# EAGLE design 220VAC power control (EAGLE 6.2)
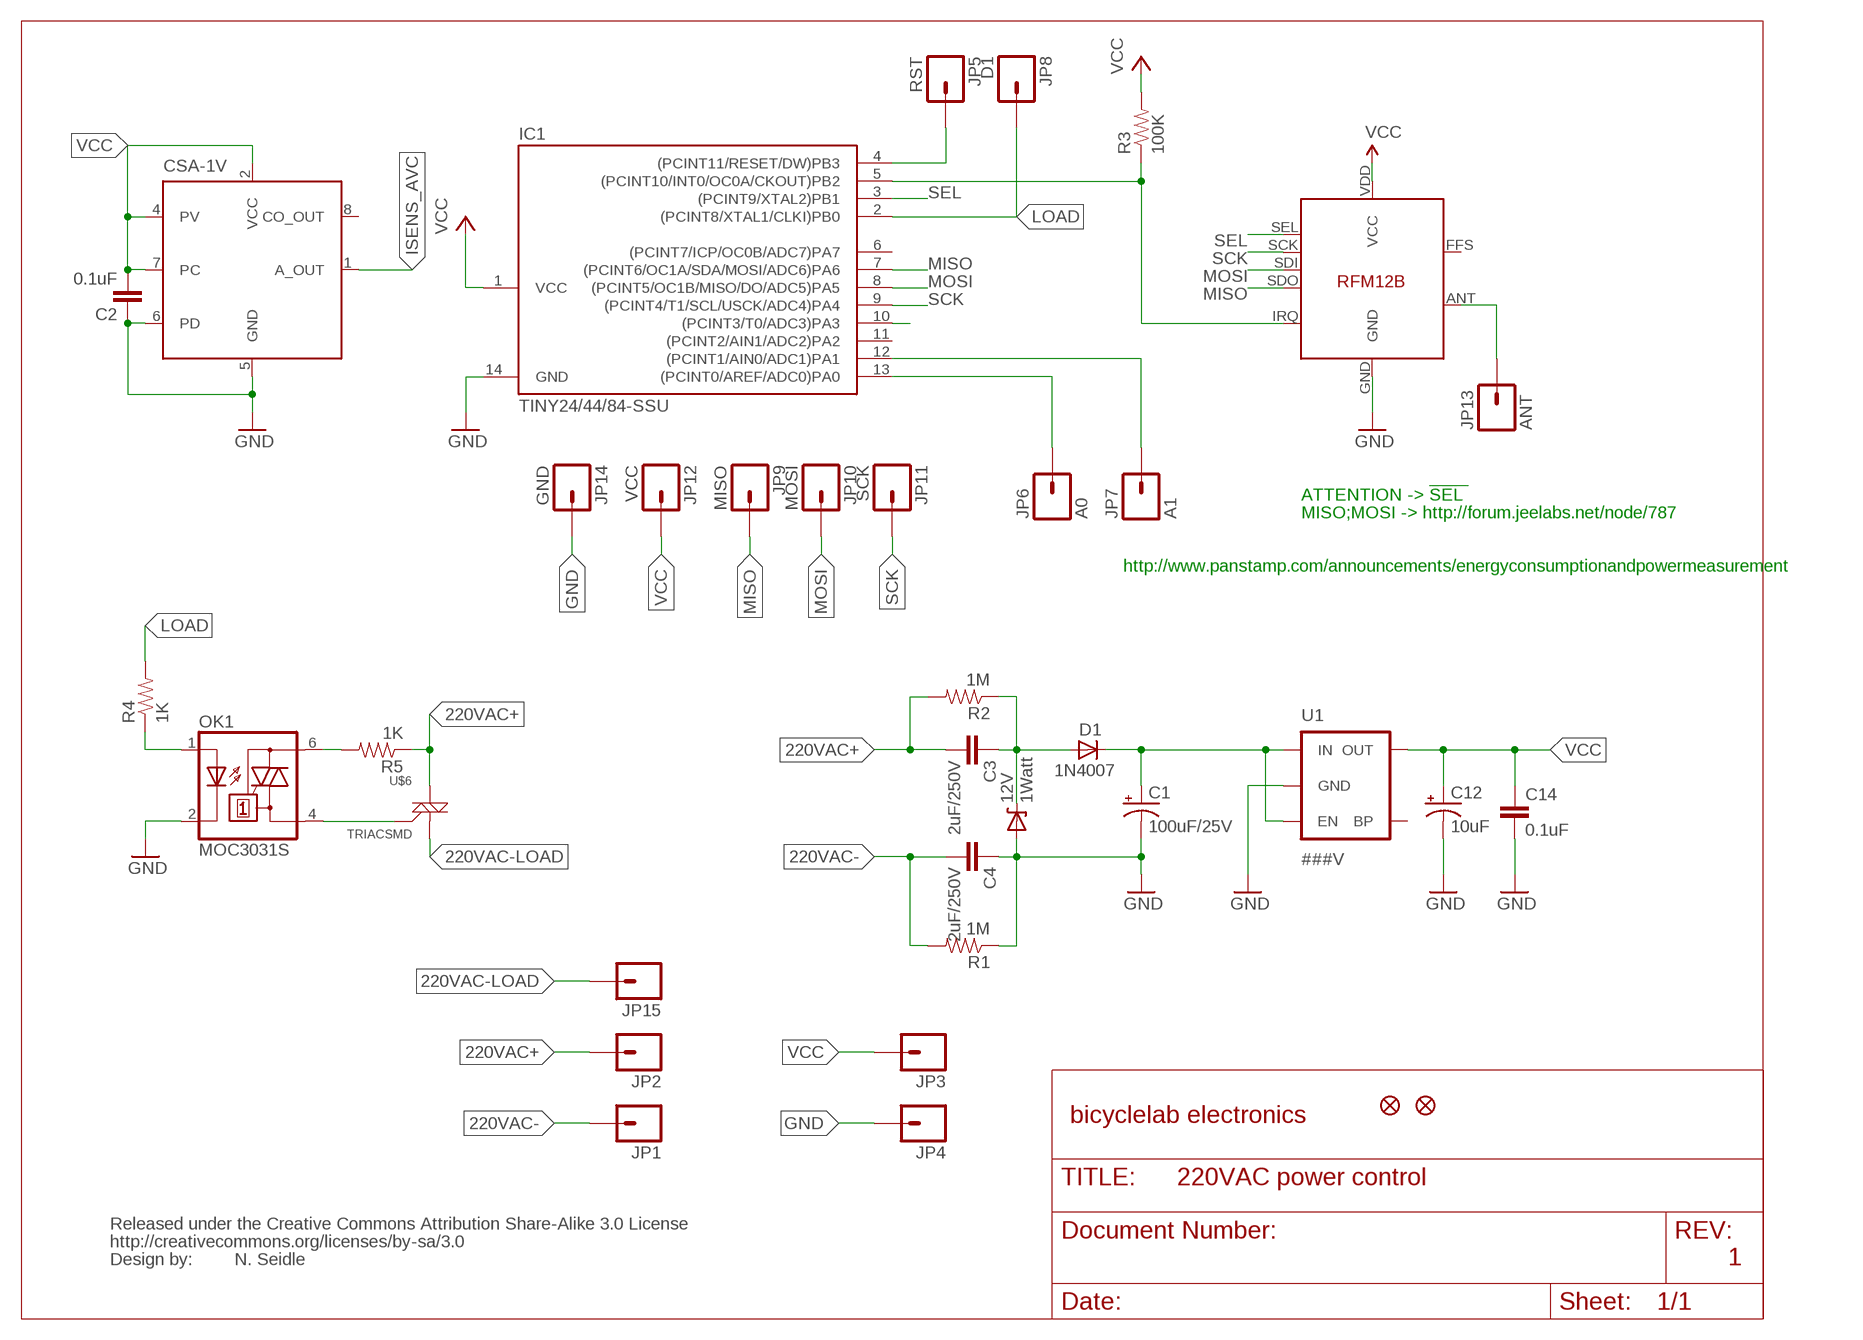
[diagram p0: schematic, sheet 1]

## Parts
12V  1Watt  DIODE-ZENERSMB  [SMB-DIODE]
C1  100uF/25V  CAP_POL7343  [EIA7343]
C2  0.1uF  CAP0603-CAP  [0603-CAP]
C3  2uF/250V  CAP0402-CAP  [0402-CAP]
C4  2uF/250V  CAP0402-CAP  [0402-CAP]
C12  10uF  CAP_POL1206  [EIA3216]
C14  0.1uF  CAP0603-CAP  [0603-CAP]
D1  1N4007  DIODESMA  [SMA-DIODE]
IC1  TINY24/44/84-SSU  [SOIC14]
JP1  M01PTH  [1X01]
JP2  M01PTH  [1X01]
JP3  M01PTH  [1X01]
JP4  M01PTH  [1X01]
JP5  RST  M01POGOPIN_HOLE_0.58  [1X01_POGOPIN_HOLE_0.58]
JP6  A0  M01POGOPIN_HOLE_0.58  [1X01_POGOPIN_HOLE_0.58]
JP7  A1  M01POGOPIN_HOLE_0.58  [1X01_POGOPIN_HOLE_0.58]
JP8  D1  M01POGOPIN_HOLE_0.58  [1X01_POGOPIN_HOLE_0.58]
JP9  MISO  M01POGOPIN_HOLE_0.58  [1X01_POGOPIN_HOLE_0.58]
JP10  MOSI  M01POGOPIN_HOLE_0.58  [1X01_POGOPIN_HOLE_0.58]
JP11  SCK  M01POGOPIN_HOLE_0.58  [1X01_POGOPIN_HOLE_0.58]
JP12  VCC  M01POGOPIN_HOLE_0.58  [1X01_POGOPIN_HOLE_0.58]
JP13  ANT  M01SMD-4.5X1.5  [PAD-1.5X4.5]
JP14  GND  M01SMDNS  [1X01NS]
JP15  M01PTH  [1X01]
OK1  MOC3031S  [DIL6-SMD]
R1  1M  RESISTOR0402-RES  [0402-RES]
R2  1M  RESISTOR0402-RES  [0402-RES]
R3  100K  RESISTOR0805-RES  [0805]
R4  1K  RESISTOR0805-RES  [0805]
R5  1K  RESISTOR0805-RES  [0805]
U1  ###V  V_REG_LDOSMD  [SOT23-5]
U$1  CSA-1V  [SOIC8]
U$2  RFM12B  [RFM12B]
U$3  FIDUCIAL1X2  [FIDUCIAL-1X2]
U$4  FIDUCIAL1X2  [FIDUCIAL-1X2]
U$5  CREATIVE_COMMONS  [CREATIVE_COMMONS]
U$6  TRIACSMD  [SOT223]

## Nets
220VAC+: C3.2 JP2.1 R2.2 R5.1 U$6.2(M2)
220VAC-: C4.2 JP1.1 R1.2
220VAC-LOAD: JP15.1 U$6.1(M1)
!RESET: IC1.4((PCINT11/RESET/DW)PB3) JP5.1
AD1: IC1.13((PCINT0/AREF/ADC0)PA0) JP6.1
GND: 12V.A C1.C(-) C2.1 C4.1 C12.C(-) C14.2 IC1.14(GND) JP4.1 JP14.1 OK1.2(C) R1.1 U1.2(GND) U$1.5(GND) U$1.6(PD) U$2.GND
ISENS_AVC: IC1.12((PCINT1/AIN0/ADC1)PA1) JP7.1 U$1.1(A_OUT)
LOAD: IC1.2((PCINT8/XTAL1/CLKI)PB0) JP8.1 R4.2
MISO: IC1.7((PCINT6/OC1A/SDA/MOSI/ADC6)PA6) JP9.1 U$2.SDO
MOSI: IC1.8((PCINT5/OC1B/MISO/DO/ADC5)PA5) JP10.1 U$2.SDI
N$1: 12V.C C3.1 D1.A R2.1
N$2: IC1.5((PCINT10/INT0/OC0A/CKOUT)PB2) R3.1 U$2.IRQ
N$4: IC1.10((PCINT3/T0/ADC3)PA3)
N$5: OK1.1(A) R4.1
N$7: C1.A(+) D1.C U1.1(IN) U1.3(EN)
N$8: OK1.6(A2) R5.2
N$9: OK1.4(A1) U$6.3(G)
N$13: JP13.P$1 U$2.ANT
SCK: IC1.9((PCINT4/T1/SCL/USCK/ADC4)PA4) JP11.1 U$2.SCK
SEL: IC1.3((PCINT9/XTAL2)PB1) U$2.SEL
VCC: C2.2 C12.A(+) C14.1 IC1.1(VCC) JP3.1 JP12.1 R3.2 U1.5(OUT) U$1.2(VCC) U$1.4(PV) U$1.7(PC) U$2.VDD(VCC)
Unconnected: IC1.6((PCINT7/ICP/OC0B/ADC7)PA7) IC1.11((PCINT2/AIN1/ADC2)PA2) U1.4(BP) U$1.3(NC) U$1.8(CO_OUT) U$2.FFS

## Notes on the sheet
- ATTENTION -> !SEL
- MISO;MOSI -> http://forum.jeelabs.net/node/787
- http://www.panstamp.com/announcements/energyconsumptionandpowermeasurement
- bicyclelab electronics
- N. Seidle | 1

## Library data of the parts
12V = 0-SparkFun:DIODE-ZENER: Zener Diode Production Part - 8199 3.4V Zener Voltage
C1 C12 = SparkFun:CAP_POL: Capacitor Polarized These are standard SMD and PTH capacitors. Normally 10uF, 47uF, and 100uF in electrolytic and tantalum varieties. Always verify the external diameter of the through hole cap, it varies with capacity, voltage, and manufacturer. The EIA devices should be standard.
C2-C4 C14 = SparkFun:CAP: Capacitor Standard 0603 ceramic capacitor, and 0.1" leaded capacitor.
D1 = SparkFun:DIODE: Diode These are standard reverse protection diodes and small signal diodes. SMA package can handle up to about 1A. SOD-323 can handle about 200mA. What the SOD-323 package when ordering, there are some mfgs out there that are 5-pin packages.
IC1 = 0-avr-7:TINY24/44/84
JP1-JP15 = SparkFun:M01: Header 1 Standard 1-pin 0.1" header. Use with straight break away headers (SKU : PRT-00116), right angle break away headers (PRT-00553), swiss pins (PRT-00743), machine pins (PRT-00117), and female headers (PRT-00115).
OK1 = optocoupler:MOC30*: 6-Pin DIP Zero-Cross Optoisolators Triac Driver Output (250/400 Volt Peak) Source: http://www.fairchildsemi.com/ds/MO/MOC3043-M.pdf; MF: FAIRCHILD SEMICONDUCTOR; MPN: MOC3031SM; OC_FARNELL: unknown; OC_NEWARK: 34C1335
R1-R5 = SparkFun:RESISTOR: Resistor Basic schematic elements and footprints for 0603, 1206, and PTH resistors.
U1 = SparkFun:V_REG_LDO: Voltage Regulator LDO Standard 150mA LDO voltage regulator in SOT-23 layout. Micrel part MIC5205. BP (by-pass) pin is used to lower output noise with 470pF cap.
U$1 = bicyclelab:CSA-1V
U$2 = JeeLabs:RFM12B
U$3 U$4 = SparkFun:FIDUCIAL: Fiducial Alignment Points Various fiducial points for machine vision alignment.
U$5 = SparkFun:CREATIVE_COMMONS
U$6 = 0-SparkFun:TRIAC

## Net classes
0 default: width 0.203 mm
1 power: width 0.508 mm

## Board
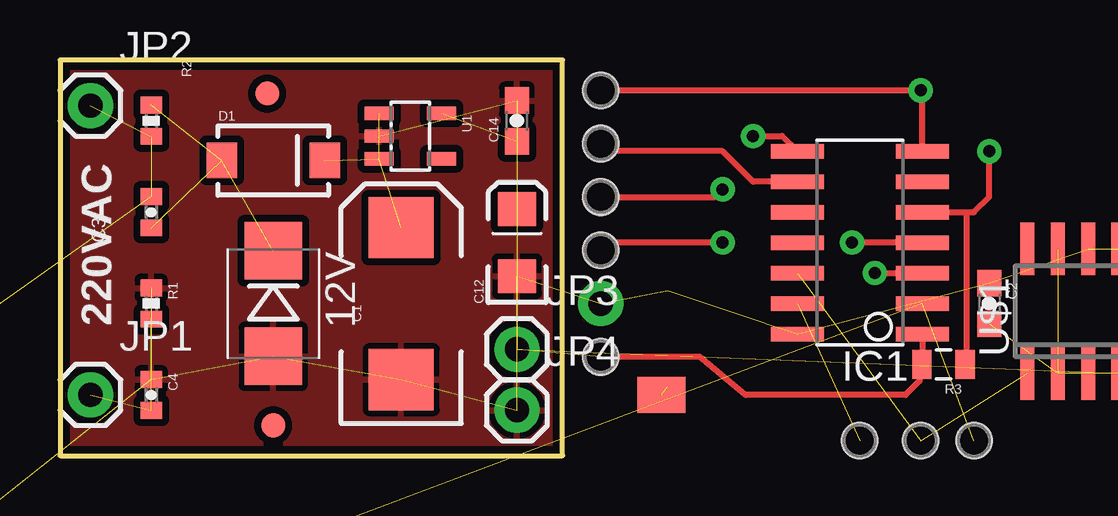
[diagram p1: board, top side]
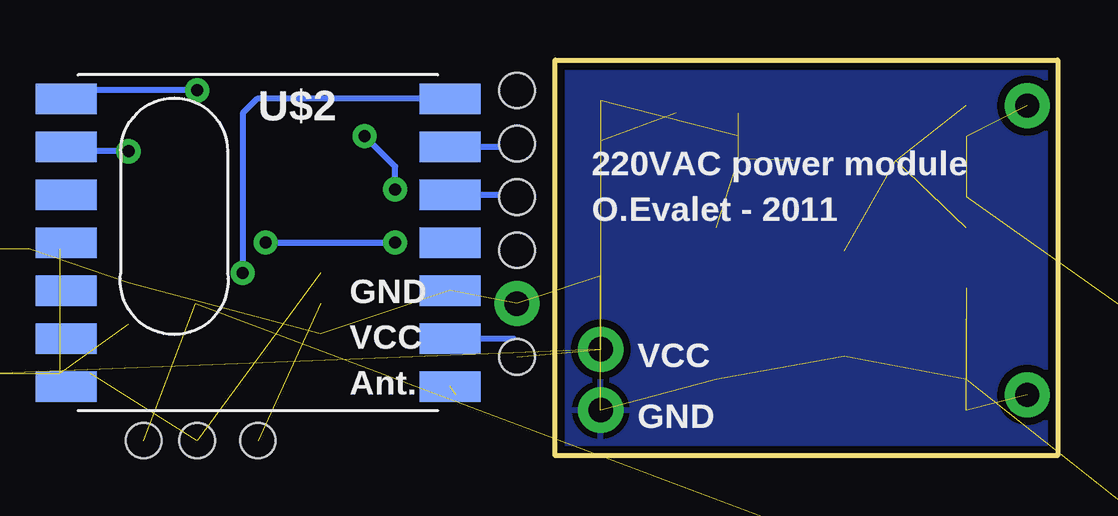
[diagram p2: board, bottom side, seen from below]

Size 20.95 x 16.51 mm. Coordinates in mm from the lower left corner, seen from the top.
Outline: 0,0 20.95,0 20.95,16.51 0,16.51 0,0
Copper layers (1*16): Top 0.035mm / dielectric 1.5mm / Bottom 0.035mm
Design rules: minimum track width 8mil, minimum drill 20mil, track to track 8mil, track to pad 8mil, pad to pad 8mil, via to via 8mil, smd to smd 8mil, copper to edge 10mil, drill to drill 8mil, minimum pad ring 12mil, minimum via ring 10mil, stop-mask expansion 4mil, vias tented up to drill 20mil, thermal gap 10mil

### Footprints (pad centres in the part's own frame; a part is rotated, then mirrored left to right if it is on the bottom)
SMB-DIODE = smd 2.4 x 2.4: A 2.2,0; C -2.2,0
EIA7343 = smd 2.55 x 2.7: A 3.17,0; C -3.17,0
0603-CAP = smd 1.1 x 1: 1 -0.85,0; 2 0.85,0
0402-CAP = smd 0.7 x 0.9: 1 -0.65,0; 2 0.65,0
EIA3216 = smd 1.4 x 1.6: A 1.4,0; C -1.4,0
SMA-DIODE = smd 1.27 x 1.47: A -2.15,0; C 2.15,0
SOIC14 = smd 0.61 x 2.21: 1 -3.81,-2.603; 2 -2.54,-2.603; 3 -1.27,-2.603; 4 0,-2.603; 5 1.27,-2.603; 6 2.54,-2.603; 7 3.81,-2.603; 8 3.81,2.603; 9 2.54,2.603; 10 1.27,2.603; 11 0,2.603; 12 -1.27,2.603; 13 -2.54,2.603; 14 -3.81,2.603
1X01 = drill 1.016 pad 1.88: 1 0,0
1X01_POGOPIN_HOLE_0.58 = drill 0.9 pad 0.813: 1 0,0 | hole 1.473: 0,0
PAD-1.5X4.5 = smd 1.5 x 2: P$1 0,0
1X01NS = drill 1.016 pad 1.88: 1 0,0
DIL6-SMD = smd 1.78 x 1.52: 1 -2.54,-4.645; 2 0,-4.645; 3 2.54,-4.645; 4 2.54,4.645; 5 0,4.645; 6 -2.54,4.645
0402-RES = smd 0.7 x 0.9: 1 -0.65,0; 2 0.65,0
0805 = smd 0.8 x 1.2: 1 -0.9,0; 2 0.9,0
SOT23-5 = smd 0.55 x 1.2: 1 -0.95,-1.3; 2 0,-1.3; 3 0.95,-1.3; 4 0.95,1.3; 5 -0.95,1.3
SOIC8 = smd 0.6 x 2.2: 1 -1.905,-2.6; 2 -0.635,-2.6; 3 0.635,-2.6; 4 1.905,-2.6; 5 1.905,2.6; 6 0.635,2.6; 7 -0.635,2.6; 8 -1.905,2.6
RFM12B = smd 2.54 x 1.27: ANT 8,-6; FFS -8,2; GND 8,-2; IRQ -8,4; P$8 -8,0; P$9 -8,-2; P$10 -8,-4; P$12 -8,-6; P$16 8,0; SCK 8,4; SDI 8,2; SDO -8,6; SEL 8,6; VDD 8,-4
FIDUCIAL-1X2 = smd 1 x 1: 1 0,0
SOT223 = smd 1.219 x 2.235: 1 -2.311,-3.099; 2 0,-3.099; 3 2.311,-3.099 | smd 3.6 x 2.2: 4 0,3.099

### Placement (x,y rotation side)
12V  8.89,6.35 270 top
C1  14.22,6.35 90 top
C2  38.73,6.35 270 top  (outside the outline)
C3  3.81,10.16 90 top
C4  3.81,2.54 270 top
C12  19.05,8.89 90 top
C14  19.05,13.97 90 top
D1  8.89,12.32 0 top
IC1  33.34,8.89 90 top  (outside the outline)
JP1  1.27,2.54 0 top
JP2  1.27,14.61 0 top
JP3  19.05,4.45 0 top
JP4  19.05,1.91 0 top
JP5  22.54,8.57 0 top
JP6  33.34,0.64 0 top  (outside the outline)
JP7  35.88,0.64 0 top  (outside the outline)
JP8  38.1,0.64 0 top  (outside the outline)
JP9  22.54,15.24 0 top
JP10  22.54,10.79 0 top
JP11  22.54,13.02 0 top
JP12  22.54,4.13 0 top
JP13  25.08,2.54 90 top  (outside the outline)
JP14  22.54,6.35 0 top
JP15  -46.04,-26.04 0 top  (outside the outline)
OK1  -27.3,-16.83 0 top  (outside the outline)
R1  3.81,6.35 270 top
R2  3.81,13.97 270 top
R3  36.83,3.81 180 top  (outside the outline)
R4  -35.88,-20.32 0 top  (outside the outline)
R5  -46.04,-20.32 0 top  (outside the outline)
U1  14.61,13.34 270 top
U$1  42.23,6.03 0 top  (outside the outline)
U$2  33.34,8.89 0 bottom  (outside the outline)
U$3  8.89,1.27 0 top
U$4  8.64,15.11 0 top
U$5  -13.34,-10.16 0 top  (outside the outline)
U$6  -40.96,-17.78 0 top  (outside the outline)

### Tracks (layer width: path | path; a pad name or v marks a point on that pad's centre or on a via)
220VAC+  (4 unrouted)
220VAC-  (2 unrouted)
220VAC-LOAD  (1 unrouted)
!RESET  (via drill 0.5)
  Top 0.254: IC1.4 v33.02,8.89 | v27.62,8.89 22.86,8.89 JP5.1
  Bottom 0.254: v33.02,8.89 v27.62,8.89
AD1  (1 unrouted)
GND  (14 unrouted)
  pour Bottom (isolate 0.305): 0,16.51 20.95,16.51 20.95,0 0,0
  pour Top (isolate 0.305): 0,0 0,16.51 20.95,16.51 20.95,0
ISENS_AVC  (2 unrouted)
LOAD  (2 unrouted)
MISO  (via drill 0.5)
  Top 0.254: JP9.1 v35.88,15.24 35.94,15.18 IC1.7
  Bottom 0.254: v35.88,15.24 40.99,15.24 U$2.SDO
MOSI  (via drill 0.5)
  Top 0.254: JP10.1 27.3,10.79 v27.62,11.11 | v28.89,13.34 30.1,13.34 IC1.8
  Bottom 0.254: v27.62,11.11 27.62,12.06 v28.89,13.34 | U$2.SDI 22.64,10.89 JP10.1
N$1  (3 unrouted)
N$2  (via drill 0.5)
  Top 0.254: 37.78,10.16 38.1,10.16 38.73,10.79 v38.73,12.7 | IC1.5 37.78,10.16 | 37.78,10.16 37.78,3.86 R3.1
  Bottom 0.254: v38.73,12.7 41.15,12.7 U$2.IRQ
N$5  (1 unrouted)
N$7  (3 unrouted)
N$8  (1 unrouted)
N$9  (1 unrouted)
N$13  (1 unrouted)
SCK
  Top 0.254: IC1.9 28.89,11.43 27.62,12.7 22.86,12.7 JP11.1
  Bottom 0.254: U$2.SCK 22.67,12.89 JP11.1
SEL  (via drill 0.5)
  Top 0.254: v33.97,7.62 IC1.3
  Bottom 0.254: U$2.SEL 33.37,14.89 33.97,14.29 v33.97,7.62
VCC  (8 unrouted)
  Top 0.254: IC1.1 35.94,3.93 R3.2 35.83,3.12 35.24,2.54 28.57,2.54 26.67,4.13 JP12.1
  Bottom 0.254: U$2.VDD 22.67,4.89 JP12.1

### Text on the board
tPlace: 220VAC | O. Evalet
bPlace: 220VAC power module | O.Evalet - 2011 | VCC | GND